# Altium schematic sheet Relay.SchDoc
size A1; SheetNumber: 4; SheetTotal: 5
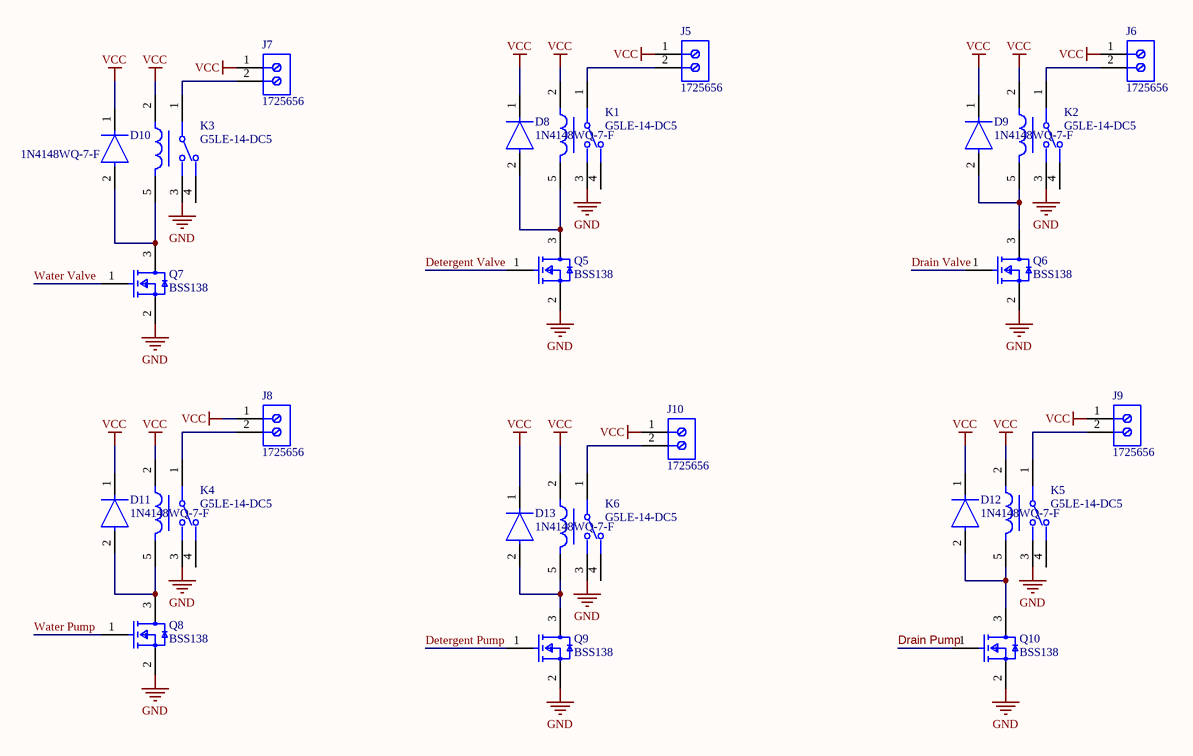
[diagram p0: Relay.SchDoc]

## Parts
D8  1N4148WQ-7-F  [FP-SOD123-MFG]
D9  1N4148WQ-7-F  [FP-SOD123-MFG]
D10  1N4148WQ-7-F  [FP-SOD123-MFG]
D11  1N4148WQ-7-F  [FP-SOD123-MFG]
D12  1N4148WQ-7-F  [FP-SOD123-MFG]
D13  1N4148WQ-7-F  [FP-SOD123-MFG]
J5  1725656  [PHOE-1725656-2]
J6  1725656  [PHOE-1725656-2]
J7  1725656  [PHOE-1725656-2]
J8  1725656  [PHOE-1725656-2]
J9  1725656  [PHOE-1725656-2]
J10  1725656  [PHOE-1725656-2]
K1  G5LE-14-DC5  [FP-G5LE-14-DC5-MFG]
K2  G5LE-14-DC5  [FP-G5LE-14-DC5-MFG]
K3  G5LE-14-DC5  [FP-G5LE-14-DC5-MFG]
K4  G5LE-14-DC5  [FP-G5LE-14-DC5-MFG]
K5  G5LE-14-DC5  [FP-G5LE-14-DC5-MFG]
K6  G5LE-14-DC5  [FP-G5LE-14-DC5-MFG]
Q5  BSS138  [FP-318-08-IPC_A]
Q6  BSS138  [FP-318-08-IPC_A]
Q7  BSS138  [FP-318-08-IPC_A]
Q8  BSS138  [FP-318-08-IPC_A]
Q9  BSS138  [FP-318-08-IPC_A]
Q10  BSS138  [FP-318-08-IPC_A]

## Nets
GND: K1.3 K2.3 K3.3 K4.3 K5.3 K6.3 Q5.2(S) Q6.2(S) Q7.2(S) Q8.2(S) Q9.2(S) Q10.2(S)
VCC: D8.1(C) D9.1(C) D10.1(C) D11.1(C) D12.1(C) D13.1(C) J5.1 J6.1 J7.1 J8.1 J9.1 J10.1 K1.2 K2.2 K3.2 K4.2 K5.2 K6.2
Detergent Pump: Q9.1(G)
Detergent Valve: Q5.1(G)
Drain Pump: Q10.1(G)
Drain Valve: Q6.1(G)
Water Pump: Q8.1(G)
Water Valve: Q7.1(G)
NetD8_2: D8.2(A) K1.5 Q5.3(D)
NetD9_2: D9.2(A) K2.5 Q6.3(D)
NetD10_2: D10.2(A) K3.5 Q7.3(D)
NetD11_2: D11.2(A) K4.5 Q8.3(D)
NetD12_2: D12.2(A) K5.5 Q10.3(D)
NetD13_2: D13.2(A) K6.5 Q9.3(D)
NetJ5_2: J5.2 K1.1
NetJ6_2: J6.2 K2.1
NetJ7_2: J7.2 K3.1
NetJ8_2: J8.2 K4.1
NetJ9_2: J9.2 K5.1
NetJ10_2: J10.2 K6.1

Not connected (* = marked no-connect by the designer): K1 4; K2 4; K3 4; K4 4; K5 4; K6 4

## Library data of the parts
D8-D13 = CMP-12791-000025-1: DIODE GEN PURP 100V 300MA SOD123; Manufacturer: Diodes Inc.; Value: 2pF; Standoff Height: 0mm; Automotive Grade: Grade 0; Max Junction Temp: +150°C; Max Surge Forward Current: 1A; Peak Reverse Current: 1uA; Forward Current: 300mA; Temperature: -65°C to +150°C; Device Class L3: Rectifier Diodes; Manufacturer Part Number: 1N4148WQ-7-F; Temperature Range Low: -65°C; Device Class L1: Discrete Semiconductors; Reverse Voltage: 100V; Automotive: Yes; Temperature Range High: +150°C; Octopart: https://octopart.com/1n4148wq-7-f-diodes+inc.-34965875; ComponentLink2URL: https://www.diodes.com/assets/Datasheets/ds30086.pdf; Max Repetitive Reverse Voltage: 100V; Mouser Description: Diode Switching 100V 0.15A Automotive 2-Pin SOD-123 T/R; Ipc Land Pattern Name: SOD365155X123-2; RoHS: TRUE; Height: 1.45mm; ComponentLink2Description: Datasheet; Category: Diode; Footprint Url: https://www.diodes.com/assets/Package-Files/SOD123.pdf; Package: SOD123; Device Class L2: Diodes; Lead Free: Yes; Capacitance: 2pF; Digikey Description: DIODE GEN PURP 100V 300MA SOD123
J5-J10 = CMP-2000-05299-1: Male Header, Pitch 2.54 mm, 1 x 2 Position, Height 9 mm, Tail Length 3.5 mm; Manufacturer: Phoenix Contact; Number of contacts: 2; Content: 250pc(s); Pitch: 2.54mm; Industrial packaging: Yes; Colour: Green; Manufacturer part No.: 1725656; Type: MPT0,5/2-2,54; Datasheet URL: http://datasheet.octopart.com/1725656-Phoenix-Contact-datasheet-5302866.pdf; Manufacturer URL: http://www.phoenixcontact.com/; Datasheet Version: Apr-08
K1-K6 = CMP-08822-000008-1: RELAY GEN PURPOSE SPDT 10A 5V; Manufacturer: Omron; Number Of Contacts: 1; Coil Type: Non-Latching; Coil Current: 79.4mA; Coil Power: 400mW; Coil Resistance: 63Ω; Standoff Height: 0.5mm; Throw Configuration: SPDT; Ambient Temperature Range Low: -25°C; Package: 0; Device Class L2: Relays; Temperature Range High: +85°C; ComponentLink2Description: Datasheet; Octopart: https://octopart.com/g5le-14-dc5-omron-28829; Coil Voltage: 5V; Lead Free: Yes; Digikey Description: RELAY GEN PURPOSE SPDT 10A 5V; Device Class L1: Electromechanical; Device Class L3: Power Relays; ComponentLink2URL: https://omronfs.omron.com/en_US/ecb/products/pdf/en-g5le.pdf; Temperature: -25°C to +85°C; Ambient Temperature Range High: +85°C; RoHS: TRUE; Automotive: No; Height: 19mm; Category: Relay; Manufacturer Part Number: G5LE-14-DC5; Mouser Description: General Purpose Relays Power PCB Relay SPDT Sealed 5VDC; Current Rating: 10A; Switching Current: 10A; Temperature Range Low: -25°C
Q5-Q10 = CMP-07173-000101-1: MOSFET N-CH 50V 220MA SOT-23; Turn-Off Delay Time: 20ns; Element Configuration: Single; Rds On Max: 3.5R; Gate to Source Voltage (Vgs): 20V; Threshold Voltage: 1.3V; Number of Elements: 1; Power Dissipation: 360mW; Rise Time: 9ns; Turn-On Delay Time: 2.5ns; Input Capacitance: 27pF; On-State Resistance: 6R; Lead Free: Lead Free; Length: 2.92mm; Width: 1.3mm; Drain to Source Breakdown Voltage: 50V; Min Operating Temperature: -55°C; REACH SVHC: No SVHC; Packaging: Tape and Reel; Radiation Hardening: No; Height: 0.93mm; Drain to Source Voltage (Vdss): 50V; Current Rating: 220mA; Voltage Rating (DC): 50V; Weight: 0.03g; Continuous Drain Current (ID): 220mA; Number of Pins: 3; Nominal Vgs: 1.3V; Max Power Dissipation: 360mW; Fall Time: 9ns; Drain to Source Resistance: 3.5R; Contact Plating: Tin; Case/Package: SOT-23; Package Quantity: 1; Dual Supply Voltage: 50V; Mount: Surface Mount; Termination: SMD/SMT; Max Operating Temperature: 150°C